# Altium schematic sheet 12v_input.SchDoc
size A; SheetNumber: 2; SheetTotal: 7
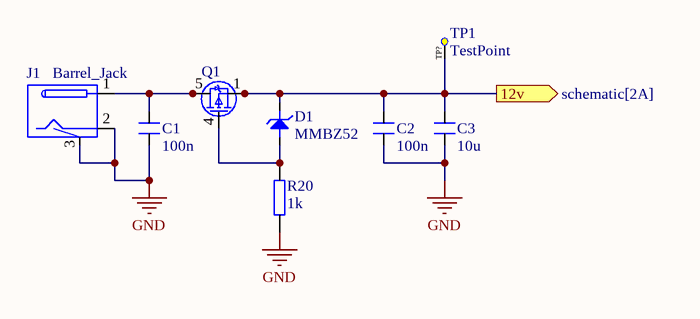
[diagram p0: 12v_input.SchDoc]

## Parts
C1  100n  [CAP_0805]
C2  100n  [CAP_0805]
C3  10u  [CAP_0805]
D1  MMBZ52  [MMBZ52]
J1  Barrel_Jack  [power jack]
Q1  Q1  [DMP3036SFV7]  (value not drawn)
R20  1k  [RES0402]
TP1  TestPoint  [Test_point]

## Ports
12v (out, see schematic[2A])

## Nets
GND: C1.1 C2.1 C3.1 J1.2 J1.3 R20.1
12v: C2.2 C3.2 D1.3(Cathode) Q1.1 Q1.2 Q1.3 TP1.TP?(Test_Point) ; port 12v
NetC1_2: C1.2 J1.1 Q1.5 Q1.6 Q1.7 Q1.8 Q1.9
NetD1_1: D1.1(Anode) Q1.4 R20.2

## Library data of the parts
C1-C3 = CAP_0805
R20 = RES 0402
TP1 = test_point